# EAGLE design injector_C (EAGLE 7.5.0)
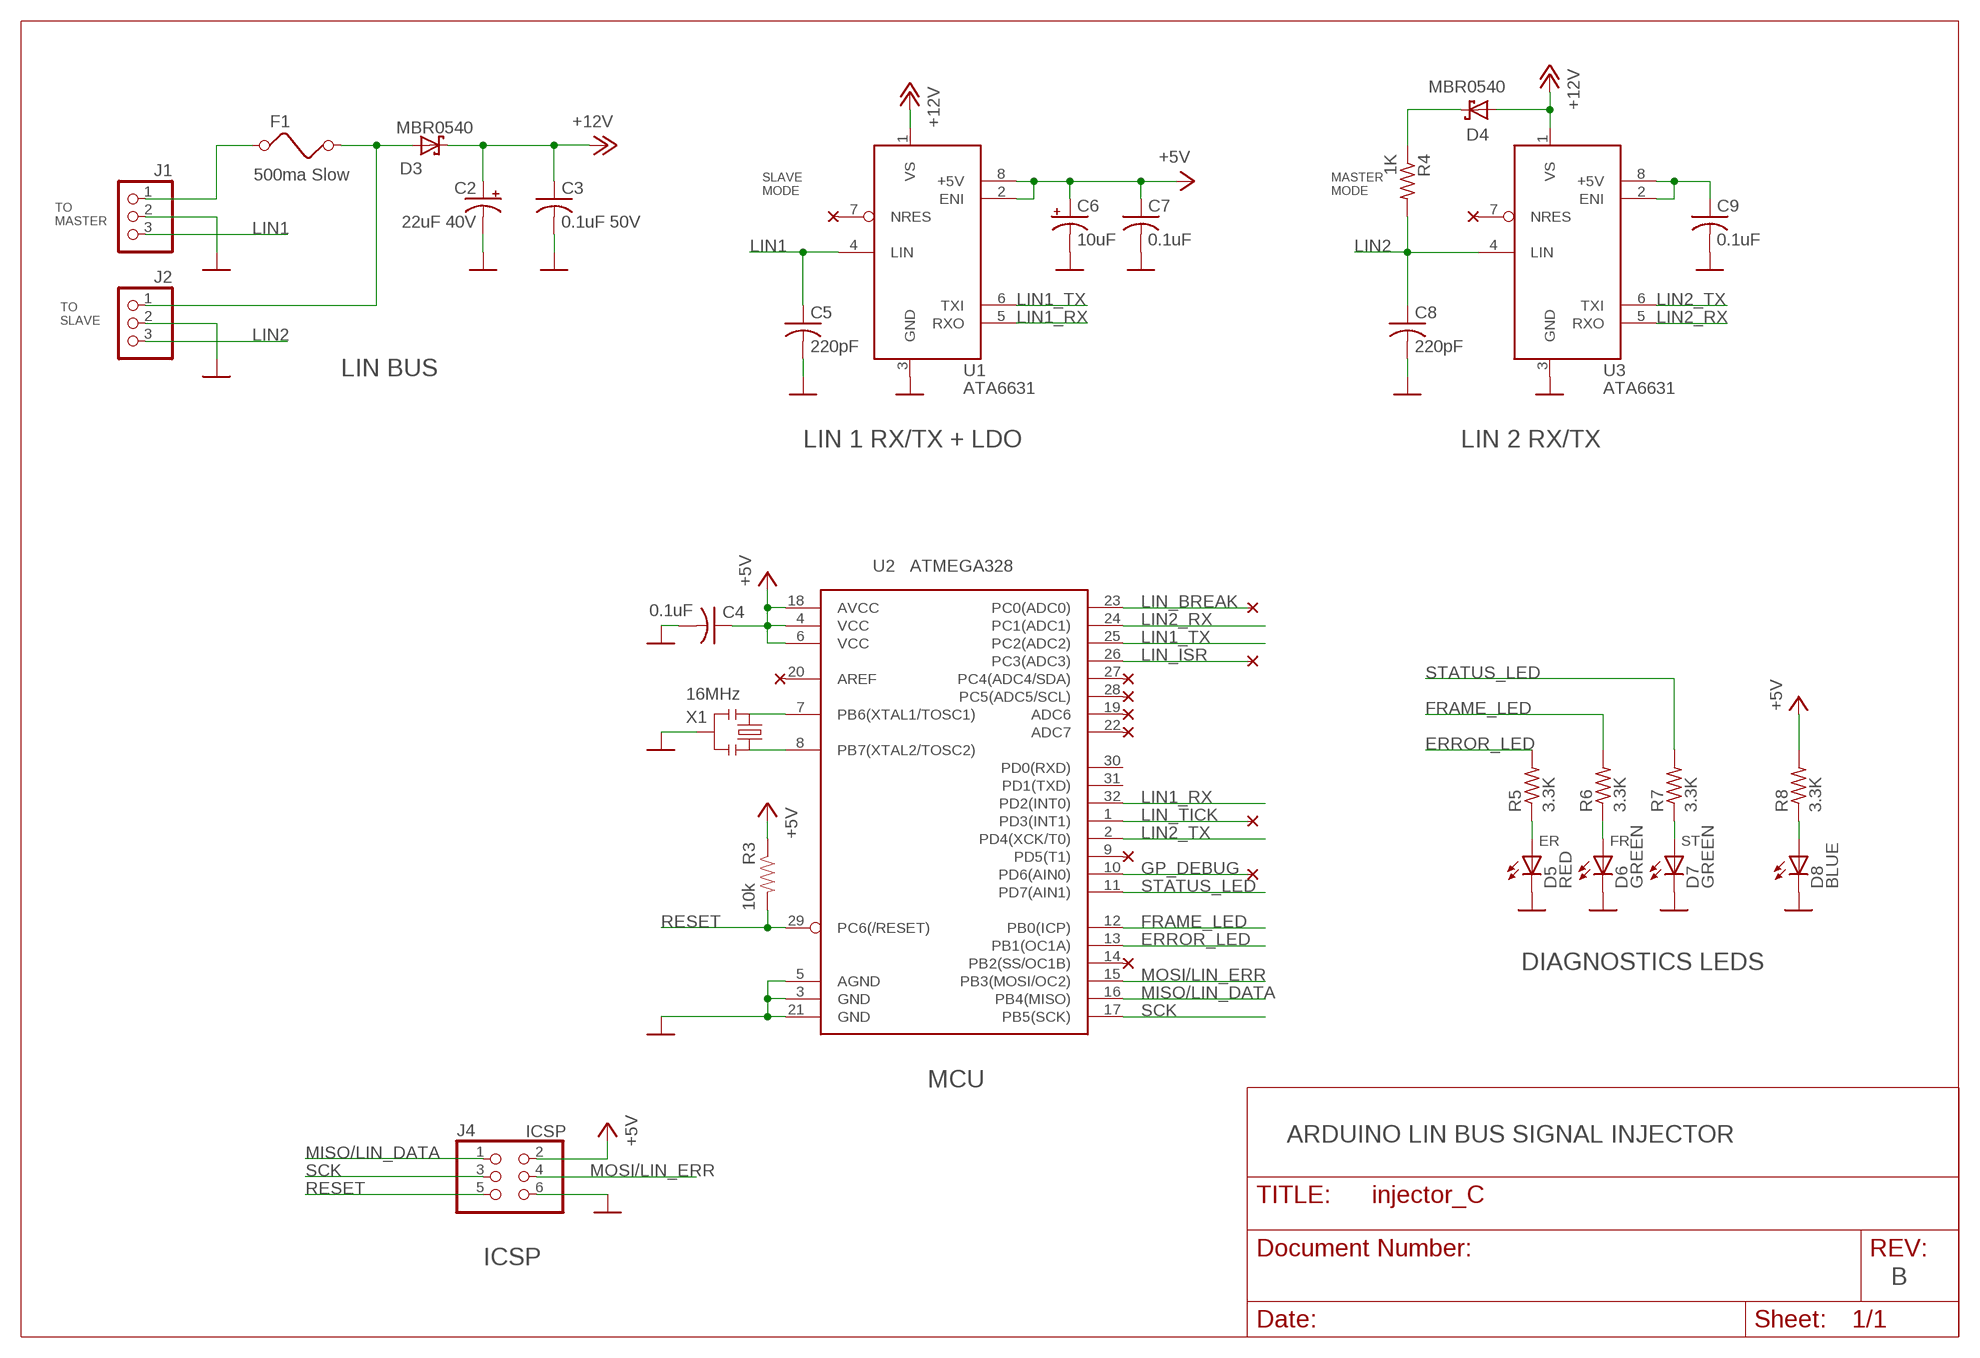
[diagram p0: schematic, sheet 1]

## Parts
C2  22uF 40V  CPOL-USUD-6,3X5,8  [UD-6,3X5,8_NICHICON]
C3  0.1uF 50V  C-USC0805  [C0805]
C4  0.1uF  C-USC0805  [C0805]
C5  220pF  C-USC0805  [C0805]
C6  10uF  CPOL-USA/3216-18R  [A/3216-18R]
C7  0.1uF  C-USC0805  [C0805]
C8  220pF  C-USC0805  [C0805]
C9  0.1uF  C-USC0805  [C0805]
D3  MBR0540  SMF5.0AT1  [SOD123FL]
D4  MBR0540  SMF5.0AT1  [SOD123FL]
D5  RED  LED  [1206-LED]
D6  GREEN  LED  [1206-LED]
D7  GREEN  LED  [1206-LED]
D8  BLUE  LED  [1206-LED]
F1  500ma Slow  FUSE  [1206]
J1  PINHD-1X3  [1X03]
J2  PINHD-1X3  [1X03]
J4  ICSP  PINHD-2X3  [2X03]
R3  10k  RESISTOR1206  [1206]
R4  1K  R-US_R0805  [R0805]
R5  3.3K  R-US_R0805  [R0805]
R6  3.3K  R-US_R0805  [R0805]
R7  3.3K  R-US_R0805  [R0805]
R8  3.3K  R-US_R0805  [R0805]
U1  ATA6631  [SO-08]
U2  ATMEGA328  [TQFP32-08]
U3  ATA6631  [SO-08]
X1  16MHz  RESONATORSMD  [RESONATOR-SMD]

## Nets
+5V: C4.1 C6.+ C7.1 J4.2 R3.1 R8.2 U1.2(ENI) U1.8(+5V) U2.4(VCC) U2.6(VCC) U2.18(AVCC)
+12V: C2.+ C3.1 D3.C D4.A U1.1(VS) U3.1(VS)
ERROR_LED: R5.2 U2.13(PB1(OC1A))
FRAME_LED: R6.2 U2.12(PB0(ICP))
GND: C2.- C3.2 C4.2 C5.2 C6.- C7.2 C8.2 C9.2 D5.C D6.C D7.C D8.C J1.2 J2.2 J4.6 U1.3(GND) U2.3(GND) U2.5(AGND) U2.21(GND) U3.3(GND) X1.2
GP_DEBUG: U2.10(PD6(AIN0))
LIN1: C5.1 J1.3 U1.4(LIN)
LIN1_RX: U1.5(RXO) U2.32(PD2(INT0))
LIN1_TX: U1.6(TXI) U2.25(PC2(ADC2))
LIN2: C8.1 J2.3 R4.2 U3.4(LIN)
LIN2_RX: U2.24(PC1(ADC1)) U3.5(RXO)
LIN2_TX: U2.2(PD4(XCK/T0)) U3.6(TXI)
LIN_BREAK: U2.23(PC0(ADC0))
LIN_ISR: U2.26(PC3(ADC3))
LIN_TICK: U2.1(PD3(INT1))
MISO/LIN_DATA: J4.1 U2.16(PB4(MISO))
MOSI/LIN_ERR: J4.4 U2.15(PB3(MOSI/OC2))
N$1: D7.A R7.1
N$2: D8.A R8.1
N$3: D6.A R6.1
N$4: D5.A R5.1
N$6: D3.A F1.2 J2.1
N$9: D4.C R4.1
RESET: J4.5 R3.2 U2.29(PC6(/RESET))
SCK: J4.3 U2.17(PB5(SCK))
SECONDARY_5V: C9.1 U3.2(ENI) U3.8(+5V)
STATUS_LED: R7.2 U2.11(PD7(AIN1))
VBAT: F1.1 J1.1
XTAL1: U2.7(PB6(XTAL1/TOSC1)) X1.3
XTAL2: U2.8(PB7(XTAL2/TOSC2)) X1.1
Unconnected: U1.7(NRES) U2.9(PD5(T1)) U2.14(PB2(SS/OC1B)) U2.19(ADC6) U2.20(AREF) U2.22(ADC7) U2.27(PC4(ADC4/SDA)) U2.28(PC5(ADC5/SCL)) U2.30(PD0(RXD)) U2.31(PD1(TXD)) U3.7(NRES)

## Notes on the sheet
- SLAVE
  MODE
- MASTER
  MODE
- TO
  MASTER
- TO
  SLAVE
- LIN BUS
- LIN 1 RX/TX + LDO | LIN 2 RX/TX
- ER | FR | ST
- DIAGNOSTICS LEDS
- MCU
- ARDUINO LIN BUS SIGNAL INJECTOR
- ICSP
- B

## Library data of the parts
C2 C6 = injector:CPOL-US
C3-C5 C7-C9 = injector:C-US
D3 D4 = injector:SMF5.0AT1
D5-D8 = injector:LED
F1 = injector:FUSE
J1 J2 = injector:PINHD-1X3
J4 = injector:PINHD-2X3
R3 = SparkFun:RESISTOR: Resistor Basic schematic elements and footprints for 0603, 1206, and PTH resistors.
R4-R8 = injector:R-US_
U1 U3 = injector:ATA6631
U2 = injector:ATMEGA328
X1 = injector:RESONATOR

## Net classes
1 vcc: width 0.254 mm

## Board
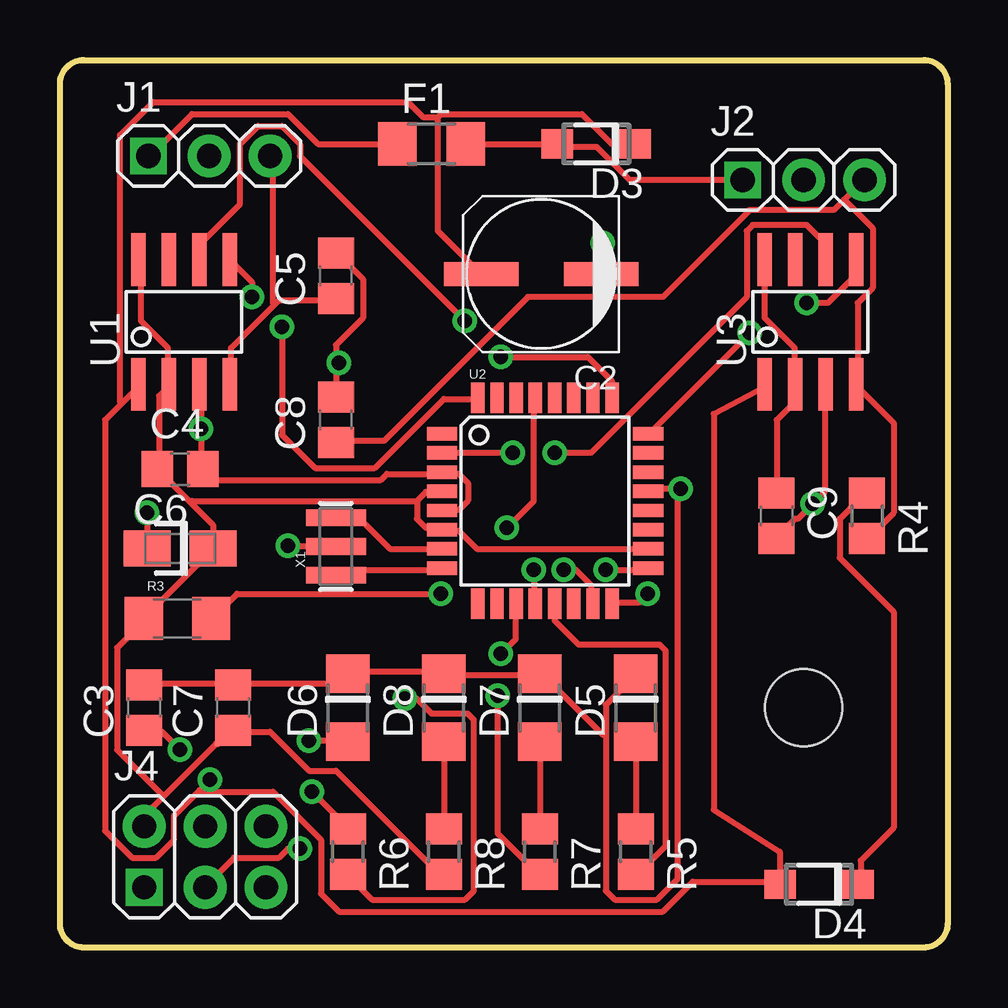
[diagram p1: board, top side]
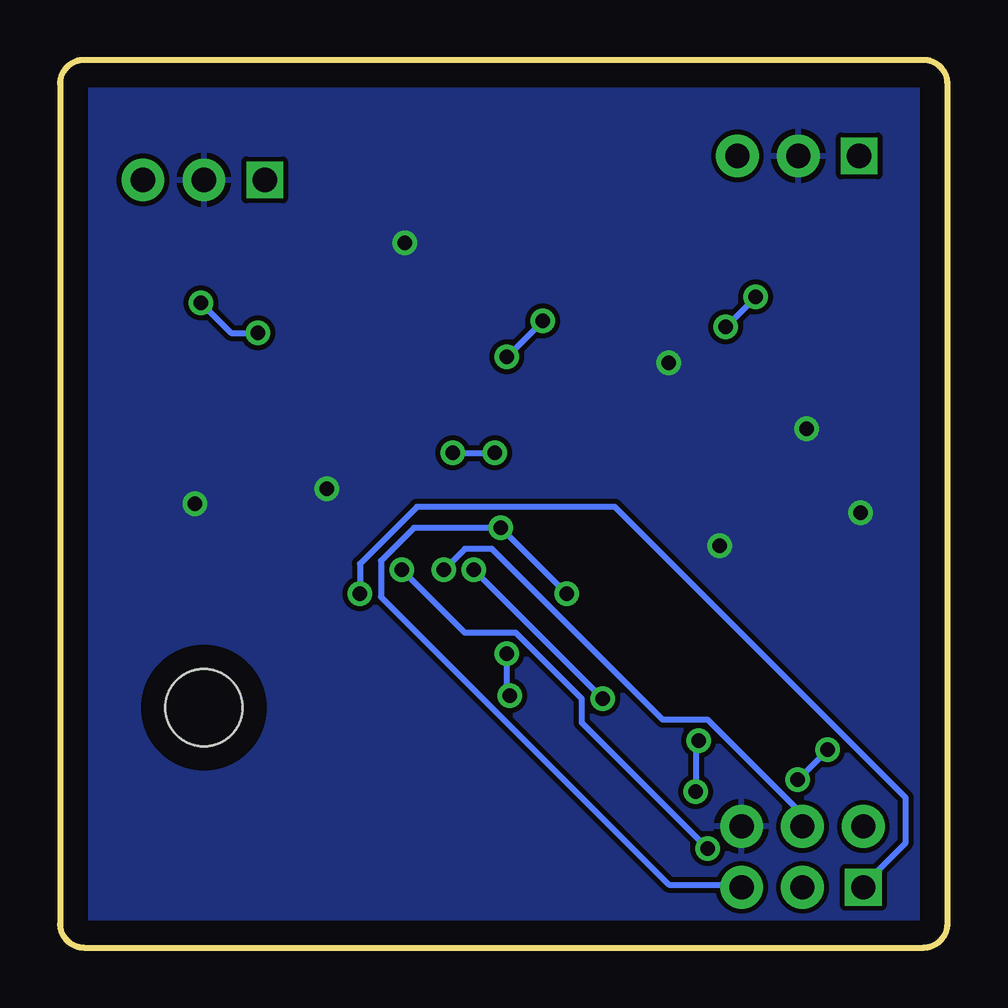
[diagram p2: board, bottom side, seen from below]

Size 37 x 37 mm. Coordinates in mm from the lower left corner, seen from the top.
Outline: 1,0 arc-90 0,1 0,36 arc-90 1,37 36,37 arc-90 37,36 37,1 arc-90 36,0 1,0
Copper layers (1*16): Top 0.035mm / dielectric 1.5mm / Bottom 0.035mm
Design rules "default": minimum track width 10mil, minimum drill 24mil, track to track 8mil, track to pad 8mil, pad to pad 8mil, via to via 8mil, smd to smd 8mil, copper to edge 40mil, drill to drill 8mil, minimum pad ring 10mil, minimum via ring 8mil, stop-mask expansion 4mil, vias tented up to drill 0mil, thermal gap 10mil
Holes 3.2 mm at 31,10

### Footprints (pad centres in the part's own frame; a part is rotated, then mirrored left to right if it is on the bottom)
UD-6,3X5,8_NICHICON = smd 3.1 x 1: + 2.5,0; - -2.5,0
C0805 = smd 1.3 x 1.5: 1 -0.95,0; 2 0.95,0
A/3216-18R = smd 1.95 x 1.5: + 1.375,0; - -1.375,0
SOD123FL = smd 1.31 x 1.22: A 1.625,0; C -1.625,0
1206-LED = smd 1.6 x 1.803: A -1.422,0; C 1.422,0
1206 = smd 1.6 x 1.803: 1 -1.422,0; 2 1.422,0
1X03 = drill 1.016 square: 1 -2.54,0 | drill 1.016 pad 1.778: 2 0,0; 3 2.54,0
2X03 = drill 1.016 square: 1 -2.54,-1.27 | drill 1.016 pad 1.778: 2 -2.54,1.27; 3 0,-1.27; 4 0,1.27; 5 2.54,-1.27; 6 2.54,1.27
1206' = smd 1.6 x 1.8: 1 -1.4,0; 2 1.4,0
R0805 = smd 1.3 x 1.5: 1 -0.95,0; 2 0.95,0
SO-08 = smd 0.6 x 2.2: 1 -1.905,-2.6; 2 -0.635,-2.6; 3 0.635,-2.6; 4 1.905,-2.6; 5 1.905,2.6; 6 0.635,2.6; 7 -0.635,2.6; 8 -1.905,2.6
TQFP32-08 = smd 1.27 x 0.559: 1 -4.293,2.8; 2 -4.293,2; 3 -4.293,1.2; 4 -4.293,0.4; 5 -4.293,-0.4; 6 -4.293,-1.2; 7 -4.293,-2; 8 -4.293,-2.8; 17 4.293,-2.8; 18 4.293,-2; 19 4.293,-1.2; 20 4.293,-0.4; 21 4.293,0.4; 22 4.293,1.2; 23 4.293,2; 24 4.293,2.8 | smd 0.559 x 1.27: 9 -2.8,-4.293; 10 -2,-4.293; 11 -1.2,-4.293; 12 -0.4,-4.293; 13 0.4,-4.293; 14 1.2,-4.293; 15 2,-4.293; 16 2.8,-4.293; 25 2.8,4.293; 26 2,4.293; 27 1.2,4.293; 28 0.4,4.293; 29 -0.4,4.293; 30 -1.2,4.293; 31 -2,4.293; 32 -2.8,4.293
RESONATOR-SMD = smd 0.7 x 2.5: 1 -1.2,0; 2 0,0; 3 1.2,0

### Placement (x,y rotation side)
C2  20.06,28.08 180 top
C3  3.51,10 90 top
C4  5.01,19.94 0 top
C5  11.5,28 90 top
C6  5.01,16.64 0 top
C7  7.22,10 90 top
C8  11.5,22 90 top
C9  29.87,18 270 top
D3  22.36,33.5 180 top
D4  31.64,2.64 180 top
D5  24,10 90 top
D6  12,10 90 top
D7  20,10 90 top
D8  16,10 90 top
F1  15.49,33.5 0 top
J1  6.22,33 0 top
J2  31,32 0 top
J4  6.05,3.78 0 top
R3  10k  [1206']  4.9,13.72 0 top
R4  33.64,18 270 top
R5  24,4 270 top
R6  12,4 270 top
R7  20,4 270 top
R8  16,4 270 top
U1  5.17,26.08 0 top
U2  20.22,18.62 0 top
U3  31.28,26.08 0 top
X1  11.5,16.72 90 top

### Tracks (layer width: path | path; a pad name or v marks a point on that pad's centre or on a via)
+5V
  Top 0.254: 4.31,6.31 3.62,5.62 3.62,5.12 J4.2 | 4.31,6.31 6.5,8.5 6.62,8.5 7.12,9 C7.1 7.25,9 8.75,9 10.38,7.38 11.5,7.38 15.75,3.12 16,3.12 R8.2 | 14.88,18.62 14.88,17.88 15.25,17.5 15.88,17.5 U2.6 16,17.38 16.62,17.38 17.38,16.62 U2.18 | 14.88,18.62 15.25,19 15.88,19 U2.4 | U1.8 3.38,28.62 3.38,26.12 4.5,25 4.5,23.5 U1.2 4.5,23.38 4.12,23 4.12,20 C4.1 5.44,18.56 | 5.44,18.56 6.38,17.62 6.38,16.75 C6.+ 6.38,16.62 3.5,13.75 R3.1 3.5,13.62 2.38,12.5 2.38,8.25 4.31,6.31 | 14.88,18.62 5.5,18.62 5.44,18.56
+12V  (via drill 0.61)
  Top 0.254: U3.1 29.38,23.38 27.25,22.25 27.25,5.75 30,4 30,2.75 D4.A 29.88,2.75 26.38,2.75 25.12,1.5 11.62,1.5 10.88,2.25 10.88,4.5 8.88,6.5 5.88,6.5 5.81,6.56 | D3.C 23,33.5 21.75,34.75 15.88,34.75 15.75,34.62 | 15.75,34.62 15.75,29.88 17.5,28.12 C2.+ | v5,8.25 4.25,9 3.62,9 C3.1 | 5.81,6.56 4.75,5.5 4.75,4.5 4,3.75 3,3.75 1.88,4.88 1.88,22 2.56,22.69 | 5.81,6.56 v6.25,7 | 2.56,22.69 3.25,23.38 U1.1 | 15.75,34.62 15.12,34.62 14.5,35.25 3.88,35.25 2.5,33.88 2.5,22.75 2.56,22.69
  Bottom 0.254: v6.25,7 v5,8.25
ERROR_LED
  Top 0.254: U2.13 20.62,14.25 20.62,13.62 21.62,12.62 25,12.62 25.25,12.38 25.25,4.25 24,3 R5.2
FRAME_LED  (via drill 0.61)
  Top 0.254: v19.75,15.75 19.75,14.38 U2.12 | v14.38,10.38 14.88,10.38 15.5,9.75 17,9.75 17.25,9.5 17.25,2.38 16.88,2 13,2 12,3 R6.2
  Bottom 0.254: v14.38,10.38 v19.75,15.75
GND  (via drill 0.61)
  Top 0.254: C3.2 3.62,11 7.12,11 C7.2 7.25,11 11.5,11 11.88,11.38 D6.C 12,11.5 16,11.5 D8.C 16.12,11.38 20,11.38 D7.C 20.12,11.38 22.62,8.88 22.75,8.88 | U2.5 16,18.25 16.62,18.25 17,18.62 17,19.38 16.62,19.75 16,19.75 U2.3 15.88,19.75 13.62,19.75 13.38,19.5 6.38,19.5 6,19.88 C4.2 5.88,20 v5.88,21.62 5.88,23.38 U1.3 | C9.2 29.88,17.12 30.62,17.88 30.75,17.88 v31.38,18.5 31.88,19 31.88,23.38 U3.3 | 11.5,24.38 11.5,25.12 12.62,26.25 12.62,27.88 11.5,29 C5.2 | 11.5,24.38 C8.2 | U2.21 24.62,19.12 v25.88,19.12 25.75,19 25.75,2.88 24.88,2 23.12,2 22.75,2.38 22.75,8.88 | 22.75,8.88 22.75,10.12 24,11.38 D5.C | v3.62,18.12 3.62,16.75 C6.- | v9.5,16.75 11.5,16.75 X1.2 | v22.62,29.38 22.62,28.12 C2.- | v11.62,24.38 11.5,24.38
  pour Bottom: 1,36 36,36 36,1 1,1
LIN1
  Top 0.254: 8.94,26.81 7.12,25 7.12,23.5 U1.4 | 8.94,26.81 9.12,27 11.5,27 C5.1 | J1.3 8.88,33 8.88,26.88 8.94,26.81
LIN1_RX  (via drill 0.61)
  Top 0.254: v9.25,25.88 9.25,21.38 10.62,20 13.12,20 16,22.88 17.38,22.88 U2.32 | v8,27.12 8,27.75 7.12,28.62 U1.5
  Bottom 0.254: v8,27.12 v9.25,25.88
LIN1_TX  (via drill 0.61)
  Top 0.254: v18.38,24.62 22,24.62 23,23.62 23,23 U2.25 | v16.88,26.12 10,33 10,33.5 9.25,34.25 8.25,34.25 7.5,33.5 7.5,31 5.88,29.38 5.88,28.75 U1.6
  Bottom 0.254: v16.88,26.12 v18.38,24.62
LIN2
  Top 0.254: R4.2 33.75,17.12 34.75,18.12 34.75,21.88 33.25,23.38 U3.4 33.25,23.5 33.25,26.88 33.88,27.5 33.88,30 32.69,31.19 | 32.69,31.19 33.5,32 J2.3 | 32.69,31.19 32.25,30.75 28.75,30.75 25.12,27.12 19.5,27.12 13.5,21.12 11.5,21.12 C8.1
LIN2_RX  (via drill 0.61)
  Top 0.254: v28.75,25.62 24.62,21.5 U2.24 | v31.12,26.88 32,26.88 33.12,28 33.12,28.62 U3.5
  Bottom 0.254: v28.75,25.62 29.88,25.62 v31.12,26.88
LIN2_TX  (via drill 0.61)
  Top 0.254: v18.88,20.62 16,20.62 U2.2 | v20.62,20.62 22.12,20.62 28.62,27.12 28.62,29.88 28.88,30.12 31.12,30.12 31.88,29.38 31.88,28.75 U3.6
  Bottom 0.254: v20.62,20.62 v18.88,20.62
MISO/LIN_DATA  (via drill 0.61)
  Top 0.254: v24.5,14.75 24.12,14.38 23.12,14.38 U2.16
  Bottom 0.254: v24.5,14.75 24.5,16 22.12,18.38 13.88,18.38 1.75,6.25 1.75,4.38 3.5,2.62 J4.1
MOSI/LIN_ERR  (via drill 0.61)
  Top 0.254: v21,15.75 21.5,15.75 22.12,15.12 22.12,14.38 U2.15
  Bottom 0.254: v21,15.75 20.12,16.62 19,16.62 11.88,9.5 10,9.5 6.12,5.62 6.12,5.12 J4.4
N$1
  Top 0.254: D7.A R7.1
N$2
  Top 0.254: D8.A R8.1
N$3  (via drill 0.61)
  Top 0.254: v10.5,6.5 12,5 R6.1 | v10.38,8.62 12,8.62 D6.A
  Bottom 0.254: v10.5,6.5 10.5,8.5 v10.38,8.62
N$4
  Top 0.254: D5.A R5.1
N$6
  Top 0.254: F1.2 D3.A 20.75,33.38 22.38,33.38 23.75,32 J2.1
N$9
  Top 0.254: D4.C 33.38,2.75 33.38,3.62 34.75,5 34.75,14 32.5,16.25 32.5,17.88 33.62,19 R4.1
RESET  (via drill 0.61)
  Top 0.254: v18.62,17.5 19.75,18.62 19.75,22.88 U2.29 | v15.88,14.75 7.38,14.75 6.38,13.75 R3.2
  Bottom 0.254: v15.88,14.75 v18.62,17.5 22.25,17.5 23.62,16.12 23.62,14.62 11.62,2.62 8.62,2.62 J4.5
SCK  (via drill 0.61)
  Top 0.254: v22.75,15.75 24.5,15.75 U2.17 | v10,4.12 9.5,4.12 9.12,3.75 7.25,3.75 6.12,2.62 J4.3
  Bottom 0.254: v22.75,15.75 20.12,13.12 18,13.12 15.25,10.38 15.25,9.38 v10,4.12
SECONDARY_5V
  Top 0.254: C9.1 29.88,19 29.88,22 30.62,22.75 30.62,23.38 U3.2 30.62,23.5 30.62,25 29.38,26.25 U3.8
STATUS_LED  (via drill 0.61)
  Top 0.254: v18.38,12.25 19,12.88 19,14.25 U2.11 | v18.25,10.5 18.25,4.75 20,3 R7.2
  Bottom 0.254: v18.38,12.25 18.38,10.62 v18.25,10.5
VBAT
  Top 0.254: F1.1 10.75,33.5 9.5,34.75 5.5,34.75 3.75,33 J1.1
XTAL1
  Top 0.254: U2.7 15.88,16.62 13.75,16.62 12.5,17.88 11.5,17.88 X1.3
XTAL2
  Top 0.254: U2.8 15.88,15.75 11.62,15.75 11.5,15.62 X1.1